# EAGLE design PCB-SSB-2x4b (EAGLE 6.4)
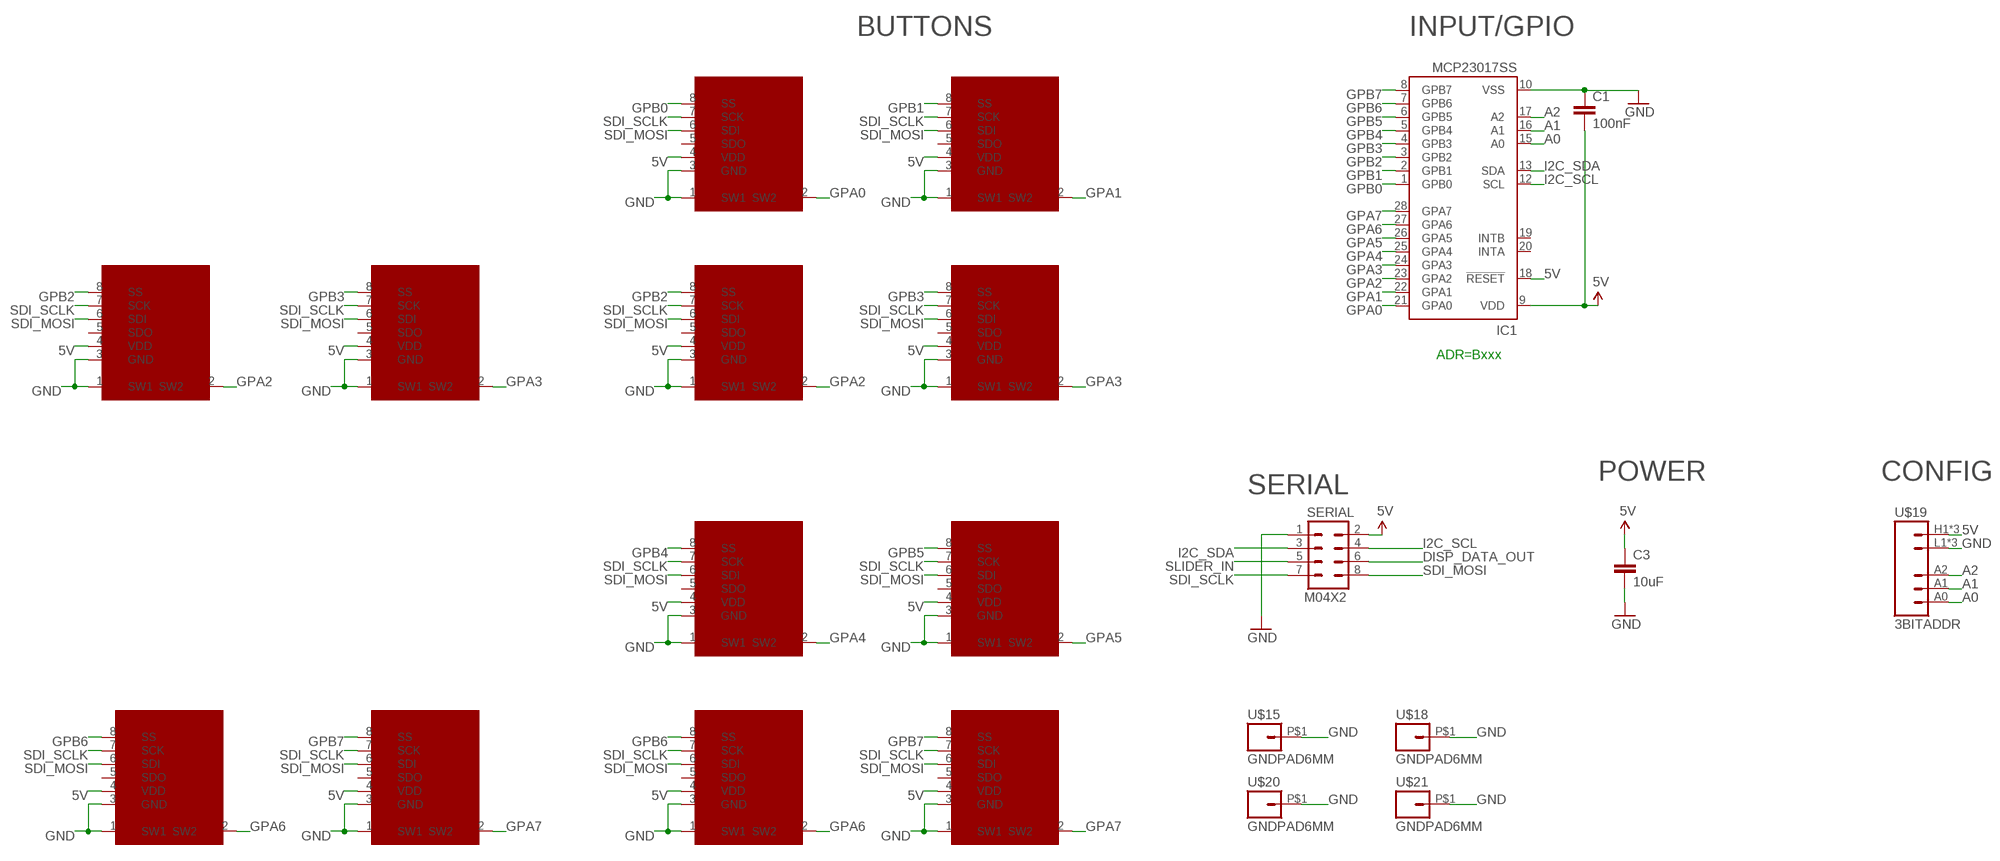
[diagram p0: schematic, sheet 1]

## Parts
C1  100nF  CAP0603-CAP  [0603-CAP]
C3  10uF  CAP0805  [0805]
IC1  MCP23017SS  [SSOP28]
SERIAL  M04X2  [2X4]
SSW1  SMART_SWITCHSMART_SWITCH_8PIN  [SMART_SWITCH]
SSW2  SMART_SWITCHSMART_SWITCH_8PIN  [SMART_SWITCH]
SSW3  SMART_SWITCHSMART_SWITCH_8PIN  [SMART_SWITCH]
SSW3ALT  SMART_SWITCHSMART_SWITCH_8PIN  [SMART_SWITCH]
SSW4  SMART_SWITCHSMART_SWITCH_8PIN  [SMART_SWITCH]
SSW4ALT  SMART_SWITCHSMART_SWITCH_8PIN  [SMART_SWITCH]
SSW5  SMART_SWITCHSMART_SWITCH_8PIN  [SMART_SWITCH]
SSW6  SMART_SWITCHSMART_SWITCH_8PIN  [SMART_SWITCH]
SSW7  SMART_SWITCHSMART_SWITCH_8PIN  [SMART_SWITCH]
SSW7ALT  SMART_SWITCHSMART_SWITCH_8PIN  [SMART_SWITCH]
SSW8  SMART_SWITCHSMART_SWITCH_8PIN  [SMART_SWITCH]
SSW8ALT  SMART_SWITCHSMART_SWITCH_8PIN  [SMART_SWITCH]
U$15  GNDPAD6MM  [3.2MMPAD6MM]
U$18  GNDPAD6MM  [3.2MMPAD6MM]
U$19  3BITADDR  [3BITADDR]
U$20  GNDPAD6MM  [3.2MMPAD6MM]
U$21  GNDPAD6MM  [3.2MMPAD6MM]

## Nets
5V [Power]: C1.2 C3.1 IC1.9(VDD) IC1.18(!RESET) SERIAL.2 SSW1.4(VDD) SSW2.4(VDD) SSW3.4(VDD) SSW3ALT.4(VDD) SSW4.4(VDD) SSW4ALT.4(VDD) SSW5.4(VDD) SSW6.4(VDD) SSW7.4(VDD) SSW7ALT.4(VDD) SSW8.4(VDD) SSW8ALT.4(VDD) U$19.H1(VCC) U$19.H2(VCC) U$19.H3(VCC)
A0: IC1.15(A0) U$19.A0
A1: IC1.16(A1) U$19.A1
A2: IC1.17(A2) U$19.A2
DISP_DATA_OUT: SERIAL.6
GND [Power]: C1.1 C3.2 IC1.10(VSS) SERIAL.1 SSW1.1(SW1) SSW1.3(GND) SSW2.1(SW1) SSW2.3(GND) SSW3.1(SW1) SSW3.3(GND) SSW3ALT.1(SW1) SSW3ALT.3(GND) SSW4.1(SW1) SSW4.3(GND) SSW4ALT.1(SW1) SSW4ALT.3(GND) SSW5.1(SW1) SSW5.3(GND) SSW6.1(SW1) SSW6.3(GND) SSW7.1(SW1) SSW7.3(GND) SSW7ALT.1(SW1) SSW7ALT.3(GND) SSW8.1(SW1) SSW8.3(GND) SSW8ALT.1(SW1) SSW8ALT.3(GND) U$15.P$1 U$18.P$1 U$19.L1(GND) U$19.L2(GND) U$19.L3(GND) U$20.P$1 U$21.P$1
GPA0: IC1.21(GPA0) SSW1.2(SW2)
GPA1: IC1.22(GPA1) SSW2.2(SW2)
GPA2: IC1.23(GPA2) SSW3.2(SW2) SSW3ALT.2(SW2)
GPA3: IC1.24(GPA3) SSW4.2(SW2) SSW4ALT.2(SW2)
GPA4: IC1.25(GPA4) SSW5.2(SW2)
GPA5: IC1.26(GPA5) SSW6.2(SW2)
GPA6: IC1.27(GPA6) SSW7.2(SW2) SSW7ALT.2(SW2)
GPA7: IC1.28(GPA7) SSW8.2(SW2) SSW8ALT.2(SW2)
GPB0: IC1.1(GPB0) SSW1.8(SS)
GPB1: IC1.2(GPB1) SSW2.8(SS)
GPB2: IC1.3(GPB2) SSW3.8(SS) SSW3ALT.8(SS)
GPB3: IC1.4(GPB3) SSW4.8(SS) SSW4ALT.8(SS)
GPB4: IC1.5(GPB4) SSW5.8(SS)
GPB5: IC1.6(GPB5) SSW6.8(SS)
GPB6: IC1.7(GPB6) SSW7.8(SS) SSW7ALT.8(SS)
GPB7: IC1.8(GPB7) SSW8.8(SS) SSW8ALT.8(SS)
I2C_SCL: IC1.12(SCL) SERIAL.4
I2C_SDA: IC1.13(SDA) SERIAL.3
SDI_MOSI: SERIAL.8 SSW1.6(SDI) SSW2.6(SDI) SSW3.6(SDI) SSW3ALT.6(SDI) SSW4.6(SDI) SSW4ALT.6(SDI) SSW5.6(SDI) SSW6.6(SDI) SSW7.6(SDI) SSW7ALT.6(SDI) SSW8.6(SDI) SSW8ALT.6(SDI)
SDI_SCLK: SERIAL.7 SSW1.7(SCK) SSW2.7(SCK) SSW3.7(SCK) SSW3ALT.7(SCK) SSW4.7(SCK) SSW4ALT.7(SCK) SSW5.7(SCK) SSW6.7(SCK) SSW7.7(SCK) SSW7ALT.7(SCK) SSW8.7(SCK) SSW8ALT.7(SCK)
SLIDER_IN: SERIAL.5
Unconnected: IC1.19(INTB) IC1.20(INTA) SSW1.5(SDO) SSW2.5(SDO) SSW3.5(SDO) SSW3ALT.5(SDO) SSW4.5(SDO) SSW4ALT.5(SDO) SSW5.5(SDO) SSW6.5(SDO) SSW7.5(SDO) SSW7ALT.5(SDO) SSW8.5(SDO) SSW8ALT.5(SDO)

## Notes on the sheet
- BUTTONS | INPUT/GPIO
- ADR=Bxxx
- POWER | CONFIG
- SERIAL

## Library data of the parts
C1 C3 = SparkFun:CAP: Capacitor Standard 0603 ceramic capacitor, and 0.1" leaded capacitor.
IC1 = microchip:MCP23017: http://ww1.microchip.com/downloads/en/DeviceDoc/21952a.pdf Source: http://ww1.microchip.com/downloads/en/DeviceDoc/21952a.pdf; MF: MICROCHIP; MPN: MCP23017-E/SS; OC_FARNELL: 1467674; OC_NEWARK: 31K2960
SERIAL = SparkFun:M04X2
SSW1-SSW3 SSW3ALT SSW4 SSW4ALT SSW5-SSW7 SSW7ALT SSW8 SSW8ALT = SKAARHOJ:SMART_SWITCH: SMARTSWITCH IS15DSBFP4RGB www.nkksmartswitch.com
U$15 U$18 U$20 U$21 = SKAARHOJ:GNDPAD
U$19 = SKAARHOJ:3BITADDR

## Net classes
0 default: width 0.203 mm, drill 0.406 mm, clearance 0.203 mm
1 Power: width 0.406 mm, drill 0.61 mm, clearance 0.203 mm

## Board
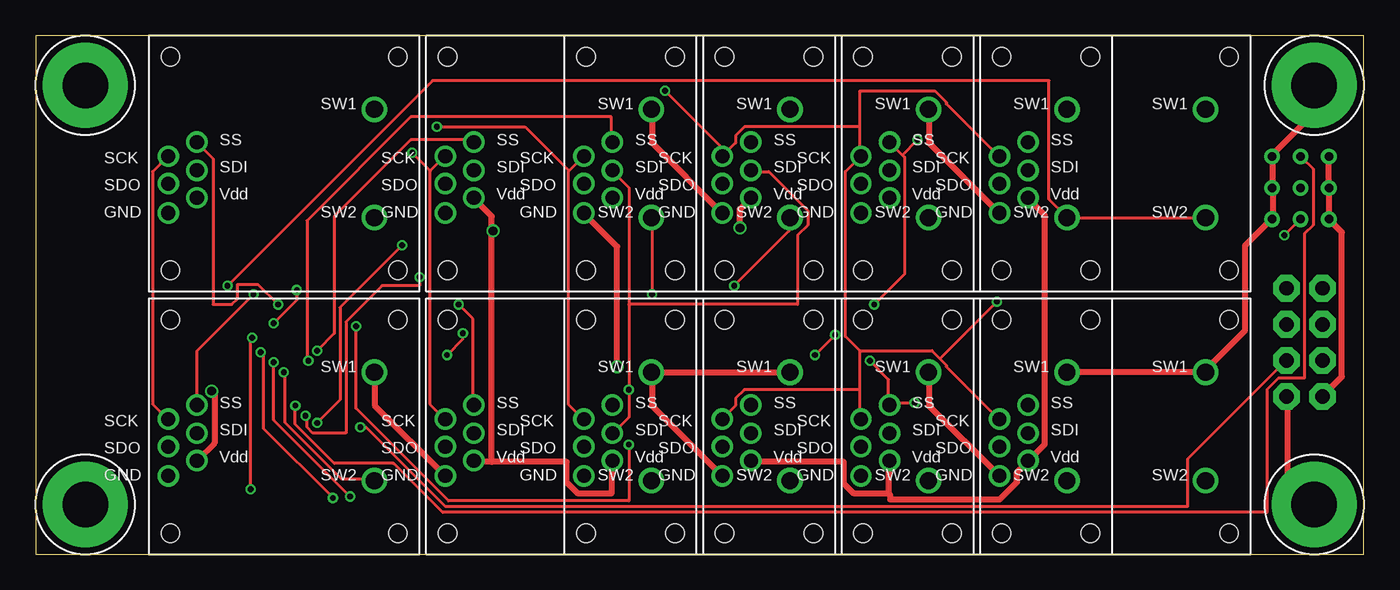
[diagram p1: board, top side]
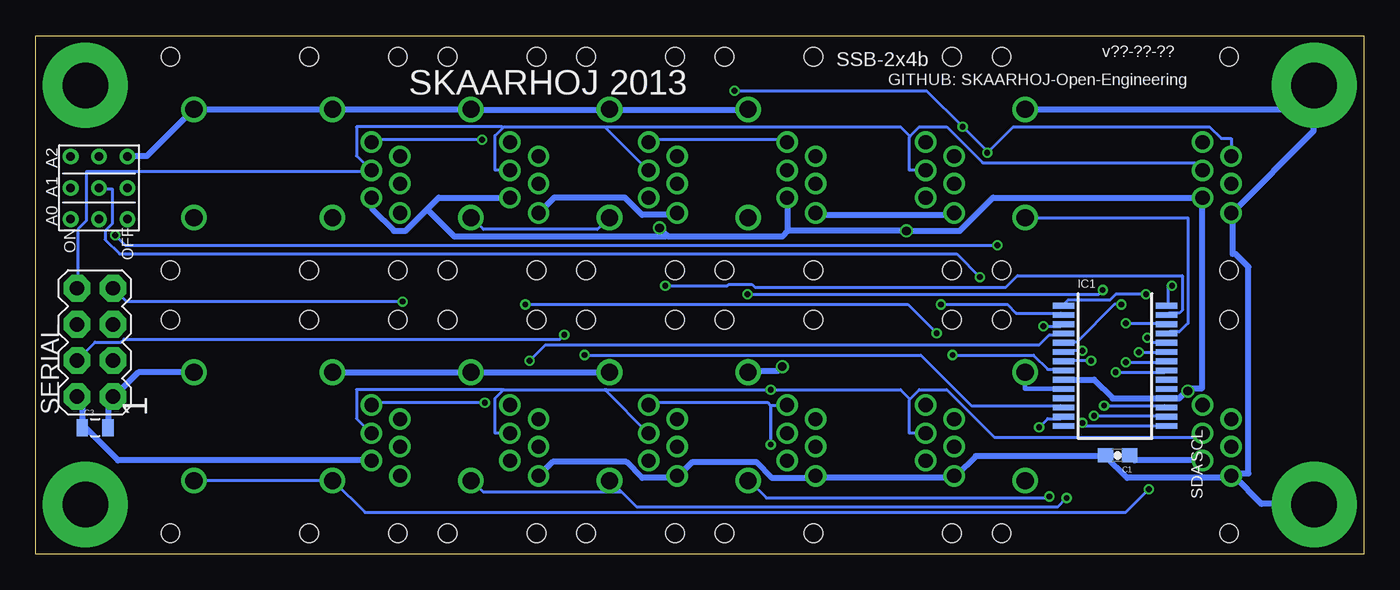
[diagram p2: board, bottom side, seen from below]

Size 93.5 x 36.5 mm. Coordinates in mm from the lower left corner, seen from the top.
Outline: 0,0 93.5,0 93.5,36.5 0,36.5 0,0
Copper layers (1*16): Top 0.035mm / dielectric 1.5mm / Bottom 0.035mm
Design rules "Fusion_eagle_rule_v1.1": minimum track width 6mil, minimum drill 12mil, track to track 6mil, track to pad 6mil, pad to pad 6mil, via to via 6mil, smd to smd 0mil, copper to edge 10mil, drill to drill 10mil, minimum pad ring 10mil, minimum via ring 6mil, stop-mask expansion 2mil, vias tented up to drill 100mil, thermal gap 10mil

### Footprints (pad centres in the part's own frame; a part is rotated, then mirrored left to right if it is on the bottom)
0603-CAP = smd 1.1 x 1: 1 -0.85,0; 2 0.85,0
0805 = smd 0.8 x 1.2: 1 -0.9,0; 2 0.9,0
SSOP28 = smd 0.4 x 1.5: 1 -4.225,-3.625; 2 -3.575,-3.625; 3 -2.925,-3.625; 4 -2.275,-3.625; 5 -1.625,-3.625; 6 -0.975,-3.625; 7 -0.325,-3.625; 8 0.325,-3.625; 9 0.975,-3.625; 10 1.625,-3.625; 11 2.275,-3.625; 12 2.925,-3.625; 13 3.575,-3.625; 14 4.225,-3.625; 15 4.225,3.625; 16 3.575,3.625; 17 2.925,3.625; 18 2.275,3.625; 19 1.625,3.625; 20 0.975,3.625; 21 0.325,3.625; 22 -0.325,3.625; 23 -0.975,3.625; 24 -1.625,3.625; 25 -2.275,3.625; 26 -2.925,3.625; 27 -3.575,3.625; 28 -4.225,3.625
2X4 = drill 1.016 pad 1.88 octagon: 1 -3.81,-1.27; 2 -3.81,1.27; 3 -1.27,-1.27; 4 -1.27,1.27; 5 1.27,-1.27; 6 1.27,1.27; 7 3.81,-1.27; 8 3.81,1.27
SMART_SWITCH = drill 1.2: 1 6.35,3.81; 2 6.35,-3.81 | drill 1: 3 -8.153,-3.48; 4 -6.147,-2.413; 5 -8.153,-1.422; 6 -6.147,-0.483; 7 -8.153,0.508; 8 -6.147,1.499 | hole 1.3: -8.001,7.506; 8.001,7.506; 8.001,-7.506; -8.001,-7.506
3.2MMPAD6MM = drill 3.2 pad 6: P$1 0,0
3BITADDR = drill 0.6: A0 -2.2,0; A1 0,0; A2 2.2,0; H1 -2.2,2; H2 0,2; H3 2.2,2; L1 -2.2,-2; L2 0,-2; L3 2.2,-2

### Placement (x,y rotation side)
C1  17.35,6.96 0 bottom
C3  89.31,8.92 0 bottom
IC1  17.52,13.26 270 bottom
SERIAL  89.31,14.91 90 bottom
SSW1  17.5,9 0 top
SSW2  37,9 0 top
SSW3  56.5,9 0 top
SSW3ALT  46.75,9 0 top
SSW4  76,9 0 top
SSW4ALT  66.25,9 0 top
SSW5  17.5,27.5 0 top
SSW6  37,27.5 0 top
SSW7  56.5,27.5 0 top
SSW7ALT  46.75,27.5 0 top
SSW8  76,27.5 0 top
SSW8ALT  66.25,27.5 0 top
U$15  3.5,3.5 0 top
U$18  3.5,33 0 top
U$19  89.03,25.78 90 bottom
U$20  90,33 0 top
U$21  90,3.5 0 top

### Tracks (layer width: path | path; a pad name or v marks a point on that pad's centre or on a via)
5V  (via drill 0.61)
  Top 0.406: U$19.H3 91.03,27.94 91.03,25.91 U$19.H2 91.03,25.7 91.03,23.67 U$19.H1 91.14,23.47 91.95,22.66 91.95,12.5 90.63,11.18 SERIAL.2 | 60.05,4.27 57.61,4.27 56.9,4.98 56.9,6.5 50.39,6.5 SSW3.4 | 60.05,4.27 60.05,6.5 SSW4ALT.4 | 60.05,4.27 60.15,4.17 60.15,3.86 67.87,3.86 69.09,5.08 69.09,5.79 69.8,6.5 SSW4.4 70,6.71 71.02,7.72 71.02,23.88 69.9,24.99 SSW8.4 | v12.39,11.48 12.6,11.28 12.6,7.82 11.38,6.6 SSW1.4 | 32.11,6.5 37.39,6.5 37.39,5.08 38.2,4.27 40.54,4.27 40.54,6.5 SSW3ALT.4 | 32.11,6.5 30.89,6.5 SSW2.4 | 32.11,6.5 32.11,22.76 | 32.11,22.76 32.11,23.77 30.89,24.99 SSW6.4 | v32.21,22.76 32.11,22.76 | v49.58,22.96 49.58,24.28 50.29,24.99 SSW7.4
  Bottom 0.406: SERIAL.2 90.53,11.07 90.22,11.07 90.22,8.94 C3.1 90.02,8.94 87.68,6.6 69.9,6.6 SSW4.4 | C1.2 16.46,6.91 16.15,6.6 11.38,6.6 SSW1.4 | IC1.9 21.13,12.29 19,12.29 17.68,10.97 13.92,10.97 IC1.18 13.72,10.97 13.01,10.97 12.45,11.53 | 12.45,11.53 12.29,11.68 11.38,11.68 11.38,24.99 SSW5.4 11.58,24.99 11.68,25.09 26.11,25.09 28.45,22.76 v32.21,22.76 40.54,22.76 | v12.39,11.48 12.45,11.53 | 65.94,24.28 67.46,22.76 68.28,22.76 69.8,24.28 69.8,24.99 SSW8.4 | 65.94,24.28 65.13,25.09 60.15,25.09 SSW8ALT.4 | 40.54,22.76 40.54,24.99 SSW7ALT.4 | 49.07,22.45 48.97,22.35 40.95,22.35 40.54,22.76 | 49.07,22.45 v49.58,22.96 | 65.94,24.28 64.01,22.35 49.17,22.35 49.07,22.45
A0  (via drill 0.41)
  Top 0.203: v19.81,9.25 21.44,10.87 21.44,17.37 v25.81,21.74 | v87.88,22.45 89,23.57 U$19.A0
  Bottom 0.203: v19.81,9.25 19.61,9.04 13.92,9.04 IC1.15 | v25.81,21.74 87.17,21.74 v87.88,22.45
A1  (via drill 0.41)
  Top 0.203: v19,9.75 19.1,9.65 19.1,8.94 19.51,8.53 21.84,8.53 21.84,16.36 24.38,18.9 27.03,18.9 v27.03,19.51
  Bottom 0.203: v19,9.75 13.92,9.75 IC1.16 | v27.03,19.51 28.65,21.13 87.58,21.13 88.59,22.15 88.59,22.76 88.09,23.27 88.09,25.7 89,25.7 U$19.A1
A2  (via drill 0.41)
  Top 0.203: v18.29,10.46 18.29,9.14 21.03,6.4 25.2,6.4 28.65,2.95 86.67,2.95 86.67,11.58 87.48,12.39 89.31,12.39 89.31,22.55 89.92,23.16 89.92,27.13 89.1,27.94 U$19.A2
  Bottom 0.203: v18.29,10.46 14.02,10.46 13.92,10.36 IC1.17
GND  (via drill 0.61)
  Top 0.406: SSW2.3 28.75,5.59 23.88,10.46 23.88,12.8 SSW1.1 | U$20.P$1 89.92,32.92 89.92,30.99 87.07,28.14 U$19.L3 87.07,27.94 87.07,25.91 U$19.L2 87.07,25.7 87.07,23.67 U$19.L1 86.87,23.47 85.14,21.74 85.14,15.75 82.4,13.01 SSW4.1 82.3,12.8 72.64,12.8 SSW4ALT.1 | SSW7.3 48.26,24.08 43.38,28.96 43.38,31.29 SSW6.1 | SSW8.3 67.77,24.08 62.89,28.96 62.89,31.29 SSW7.1 | SSW3.3 48.26,5.59 43.38,10.46 43.38,12.8 SSW2.1 43.59,12.8 53.03,12.8 SSW3ALT.1 | v40.95,13.21 40.95,21.64 38.61,23.98 SSW7ALT.3 | SSW4.3 67.77,5.59 62.89,10.46 62.89,12.8 SSW3.1 | U$21.P$1 89.92,3.56 88.09,5.38 88.09,11.07 SERIAL.1
  Bottom 0.305: IC1.10 23.85,11.63 SSW1.1
  Bottom 0.406: SSW5.1 23.77,31.29 3.66,31.29 U$18.P$1 3.56,32.92 3.56,29.77 9.25,24.08 SSW5.3 9.25,23.88 9.25,21.13 9.04,21.13 8.13,20.22 8.13,5.69 9.14,5.69 SSW1.3 | SSW1.3 9.35,5.49 9.45,5.38 16.66,5.38 18.19,6.91 C1.1 18.39,6.91 27.33,6.91 28.65,5.59 SSW2.3 28.85,5.49 28.96,5.38 38.41,5.38 38.51,5.49 SSW3ALT.3 38.71,5.38 41.66,5.38 42.77,6.5 47.24,6.5 48.16,5.59 SSW3.3 48.36,5.49 48.46,5.38 50.8,5.38 51.92,6.5 57.1,6.5 58.01,5.59 SSW4ALT.3 | SSW1.3 9.14,5.49 7.21,3.56 3.56,3.56 U$15.P$1 | U$19.L3 86.97,28.04 85.65,28.04 82.4,31.29 SSW8.1 82.19,31.29 72.75,31.29 SSW8ALT.1 72.54,31.29 62.99,31.29 SSW7.1 62.79,31.29 53.14,31.29 SSW7ALT.1 52.93,31.29 43.38,31.29 SSW6.1 | SSW8ALT.3 58.01,24.08 57,25.09 52.02,25.09 50.8,23.88 48.46,23.88 48.36,23.98 SSW7.3 | SSW6.3 28.85,23.98 28.96,23.88 38.41,23.88 38.51,23.98 SSW7ALT.3 | v40.95,13.21 41.25,12.9 43.28,12.9 SSW2.1 | C3.2 88.39,8.94 88.39,11.07 88.09,11.07 SERIAL.1 87.88,11.18 86.26,12.8 82.4,12.8 SSW4.1 | SSW4ALT.1 72.54,12.8 62.89,12.8 SSW3.1 62.69,12.8 53.14,12.8 SSW3ALT.1
GPA0  (via drill 0.41)
  Top 0.203: v17.48,12.8 17.58,12.7 17.58,9.25 21.54,5.28 23.77,5.28 SSW1.2
  Bottom 0.203: v17.48,12.8 14.02,12.8 13.92,12.9 IC1.21
GPA1  (via drill 0.41)
  Top 0.203: v16.76,13.51 16.76,9.45 v22.15,4.06
  Bottom 0.203: v16.76,13.51 13.92,13.51 IC1.22 | v22.15,4.06 22.25,3.96 42.06,3.96 43.28,5.18 SSW2.2
GPA2  (via drill 0.41)
  Top 0.203: v15.85,14.22 16.05,14.02 16.05,8.84 v20.93,3.96
  Bottom 0.203: v15.85,14.22 13.92,14.22 IC1.23 | v20.93,3.96 21.54,3.35 51.21,3.35 52.27,4.42 | 52.27,4.42 53.03,5.18 SSW3ALT.2 | SSW3.2 62.79,5.18 61.98,4.37 52.32,4.37 52.27,4.42
GPA3  (via drill 0.41)
  Top 0.203: v15.24,15.24 15.14,15.14 v15.14,4.57
  Bottom 0.203: v15.24,15.24 14.94,14.94 13.92,14.94 IC1.24 | v15.14,4.57 16.76,2.95 70.31,2.95 72.54,5.18 SSW4ALT.2 72.64,5.18 82.3,5.18 SSW4.2
GPA4
  Bottom 0.203: IC1.25 13.82,15.54 13.72,15.65 13.01,15.65 12.39,16.26 12.39,23.67 23.77,23.67 SSW5.2
GPA5  (via drill 0.41)
  Top 0.203: v16.76,16.26 18.39,17.88 v18.39,18.59 | v43.38,18.29 43.38,23.67 SSW6.2
  Bottom 0.203: v16.76,16.26 13.92,16.26 IC1.26 | v18.39,18.59 18.69,18.29 v43.38,18.29
GPA6  (via drill 0.41)
  Top 0.203: v49.17,18.9 53.03,22.76 53.03,23.67 SSW7ALT.2
  Bottom 0.203: v49.17,18.9 44.81,18.9 44.7,19 43.08,19 42.88,18.8 25.2,18.8 24.38,19.61 12.8,19.61 12.8,17.17 13.01,16.97 13.72,16.97 13.82,16.87 IC1.27 | SSW7.2 62.79,23.67 61.98,22.86 53.95,22.86 53.14,23.67 SSW7ALT.2
GPA7  (via drill 0.41)
  Top 0.203: v13.51,18.9 27.94,33.33 71.32,33.33 71.32,24.99 72.54,23.77 SSW8ALT.2 72.64,23.67 82.3,23.67 SSW8.2
  Bottom 0.203: v13.51,18.9 13.82,18.9 13.82,17.58 IC1.28
GPB0  (via drill 0.41)
  Top 0.203: v15.34,18.29 11.38,14.33 11.38,10.57 SSW1.8
  Bottom 0.203: v15.34,18.29 17.48,18.29 17.88,17.88 20.83,17.88 21.13,17.58 IC1.1
GPB1  (via drill 0.41)
  Top 0.203: v29.77,17.58 30.79,16.56 30.79,10.57 SSW2.8
  Bottom 0.203: v29.77,17.58 25.09,17.58 24.49,16.97 21.34,16.97 21.23,16.87 IC1.2
GPB2  (via drill 0.41)
  Top 0.203: v22.55,16.05 22.55,10.26 29.06,3.76 41.76,3.76 v41.76,7.72
  Bottom 0.203: v22.55,16.05 21.34,16.05 21.23,16.15 IC1.3 | 41.76,10.46 v41.76,7.72 | 41.76,10.46 40.64,10.46 SSW3ALT.8 | 41.76,10.46 41.96,10.67 50.19,10.67 50.29,10.57 SSW3.8
GPB3  (via drill 0.41)
  Top 0.203: v58.73,13.61 60.05,12.29 60.05,10.67 | 60.05,10.67 60.05,10.57 SSW4ALT.8 60.05,10.67 | 60.05,10.67 v61.87,10.67
  Bottom 0.203: v58.73,13.61 57.61,14.73 22.86,14.73 22.15,15.44 21.23,15.44 IC1.4 | v61.87,10.67 69.7,10.67 69.8,10.57 SSW4.8
GPB4  (via drill 0.41)
  Top 0.203: v17.07,17.58 15.65,19 14.22,19 14.22,17.98 13.82,17.58 12.5,17.58 12.5,27.84 11.38,28.96 SSW5.8
  Bottom 0.203: v17.07,17.58 17.58,17.58 20.22,14.94 21.13,14.94 IC1.5
GPB5  (via drill 0.41)
  Top 0.203: v19.81,14.33 21.03,15.54 21.03,23.77 26.42,29.16 30.79,29.16 30.79,29.06 SSW6.8
  Bottom 0.203: v19.81,14.33 21.13,14.33 IC1.6
GPB6  (via drill 0.41)
  Top 0.203: v19.2,13.61 19.1,13.72 19.1,23.47 26.42,30.79 40.54,30.79 40.54,29.06 SSW7ALT.8
  Bottom 0.203: v19.2,13.61 21.13,13.61 IC1.7 | SSW7.8 50.29,29.06 50.19,29.16 40.74,29.16 40.64,29.06 SSW7ALT.8
GPB7  (via drill 0.41)
  Top 0.203: v28.96,14.02 30.07,15.14 v30.07,15.54 | v59.03,17.58 61.16,19.71 61.16,27.94 61.01,28.09 | 61.01,28.09 60.15,28.96 SSW8ALT.8 | 61.01,28.09 v62.08,29.16
  Bottom 0.203: v28.96,14.02 23.27,14.02 22.25,13.01 21.23,13.01 IC1.8 | v30.07,15.54 32.11,17.58 v59.03,17.58 | v62.08,29.16 69.7,29.16 69.8,29.06 SSW8.8
I2C_SCL  (via drill 0.41)
  Top 0.203: v56.29,15.44 v54.86,14.02
  Bottom 0.203: v54.86,14.02 31.19,14.02 27.64,10.46 21.34,10.46 21.23,10.36 IC1.12 | v56.29,15.44 56.59,15.14 87.27,15.14 87.48,14.94 89.31,14.94 90.53,13.72 SERIAL.4
I2C_SDA  (via drill 0.41)
  Top 0.203: v22.86,8.94 23.27,8.94 28.85,3.35 81.08,3.35 81.08,6.71 87.99,13.61 SERIAL.3
  Bottom 0.203: v22.86,8.94 22.25,9.55 21.34,9.55 21.23,9.65 IC1.13
SDI_MOSI  (via drill 0.41)
  Top 0.203: 41.76,17.58 41.76,25.81 40.64,26.92 SSW7ALT.6 | 41.76,17.58 v41.76,11.58 41.76,9.65 40.64,8.53 SSW3ALT.6 | 41.76,17.58 53.65,17.58 53.65,22.45 54.36,23.16 54.36,24.18 51.61,26.92 50.39,26.92 SSW7.6
  Bottom 0.203: 31.95,10.92 32,10.87 32,8.53 30.89,8.53 SSW2.6 | 31.95,10.92 31.29,11.58 29.36,11.58 26.01,8.23 11.58,8.23 11.38,8.43 SSW1.6 | 53.39,11.53 53.44,11.58 60.55,11.58 60.6,11.53 | 53.39,11.53 50.39,8.53 SSW3.6 | 60.6,11.53 61.16,10.97 61.16,8.53 60.15,8.53 SSW4ALT.6 | SSW4.6 69.9,8.53 70.92,9.55 70.92,11.58 60.66,11.58 60.6,11.53 | 31.95,10.92 32.61,11.58 v41.76,11.58 53.34,11.58 53.39,11.53 | 31.95,29.41 32,29.36 32,27.03 30.89,27.03 SSW6.6 | 31.95,29.41 31.29,30.07 29.36,30.07 26.82,27.53 11.89,27.53 11.38,27.03 SSW5.6 | 53.39,30.02 53.44,30.07 60.55,30.07 60.6,30.02 | 53.39,30.02 50.39,27.03 SSW7.6 | 60.6,30.02 61.16,29.46 61.16,27.03 60.15,27.03 SSW8ALT.6 | 60.6,30.02 60.66,30.07 70.92,30.07 70.92,28.04 69.9,27.03 SSW8.6 69.9,26.92 89.92,26.92 89.92,23.47 90.53,22.86 90.53,18.8 SERIAL.8 | 31.95,29.41 32.61,30.07 53.34,30.07 53.39,30.02
SDI_SCLK  (via drill 0.41)
  Top 0.203: 37.54,26.98 38.51,27.94 SSW7ALT.7 | 37.54,26.98 37.49,26.92 37.49,10.57 38.51,9.55 SSW3ALT.7 | SSW1.7 9.25,9.55 8.23,10.57 8.23,26.92 9.25,27.94 SSW5.7 | 27.79,26.98 28.75,27.94 SSW6.7 | 27.79,26.98 27.74,26.92 27.74,10.57 28.75,9.55 SSW2.7 | 27.79,26.98 v26.52,28.25 | 37.54,26.98 34.44,30.07 v28.25,30.07 | 58.01,30.07 49.89,30.07 49.28,29.46 49.28,28.96 48.36,28.04 SSW7.7 48.56,28.35 v44.3,32.61 | 58.01,30.07 58.01,28.04 SSW8ALT.7 58.01,27.94 57,26.92 57,15.34 58.01,14.33 | 58.01,30.07 58.01,32.61 63.3,32.61 64.11,31.8 64.11,31.7 67.77,28.04 SSW8.7 | 58.01,11.58 49.89,11.58 49.28,10.97 49.28,10.46 48.36,9.55 SSW3.7 | 58.01,11.58 58.01,9.55 SSW4ALT.7 | 63.65,13.77 63.09,14.33 58.01,14.33 | 63.65,13.77 64.11,13.31 64.11,13.21 67.77,9.55 SSW4.7 | 58.01,11.58 58.01,14.33 | 63.65,13.77 v67.67,17.78
  Bottom 0.203: SSW5.7 9.35,28.04 9.35,29.26 10.06,29.26 10.87,30.07 24.69,30.07 v26.52,28.25 26.52,28.35 v28.25,30.07 30.79,32.61 v44.3,32.61 | v67.67,17.78 87.07,17.78 87.99,18.69 SERIAL.7

### Text on the board
_bsilk: v??-??-?? | SSB-2x4b | GITHUB: SKAARHOJ-Open-Engineering | SKAARHOJ 2013 | 1 | SCL | SDA